# Altium schematic sheet TIDA-010954-Control.SchDoc
size 431 x 279 mm; Date: Not shown in title block; ApprovedBy: Not shown in title block; CheckedBy: Not shown in title block; Author: Not shown in title block; CompanyName: Not shown in title block; Engineer: Not shown in title block; Organization: Not shown in title block; Address1: Not shown in title block; Address2: Not shown in title block; Address3: Not shown in title block; Address4: Not shown in title block; DocumentNumber: 2; Revision: Use project parameter SCH_Rev; SheetNumber: 8; SheetTotal: 9; PageSetup: Record=PageOptions|CenterHorizontal=True|CenterVertical=True|PrintScale=1.00|XCorrection=1.00|YCorrection=1.00|PrintKind=0|BorderSize=5000000|LeftOffset=0|BottomOffset=0|Orientation=2|PaperLength=1000|PaperWidth=1000|Scale=100|PaperSource=15|PrintQuality=600|MediaType=1|DitherType=10|PaperKind=Letter|PrintScaleMode=1; CurrentTime: Not shown in title block; CurrentDate: Not shown in title block; Time: Not shown in title block; DocumentFullPathAndName: Not shown in title block; DocumentName: Not shown in title block; ModifiedDate: 1/25/2022; ImagePath: Not shown in title block
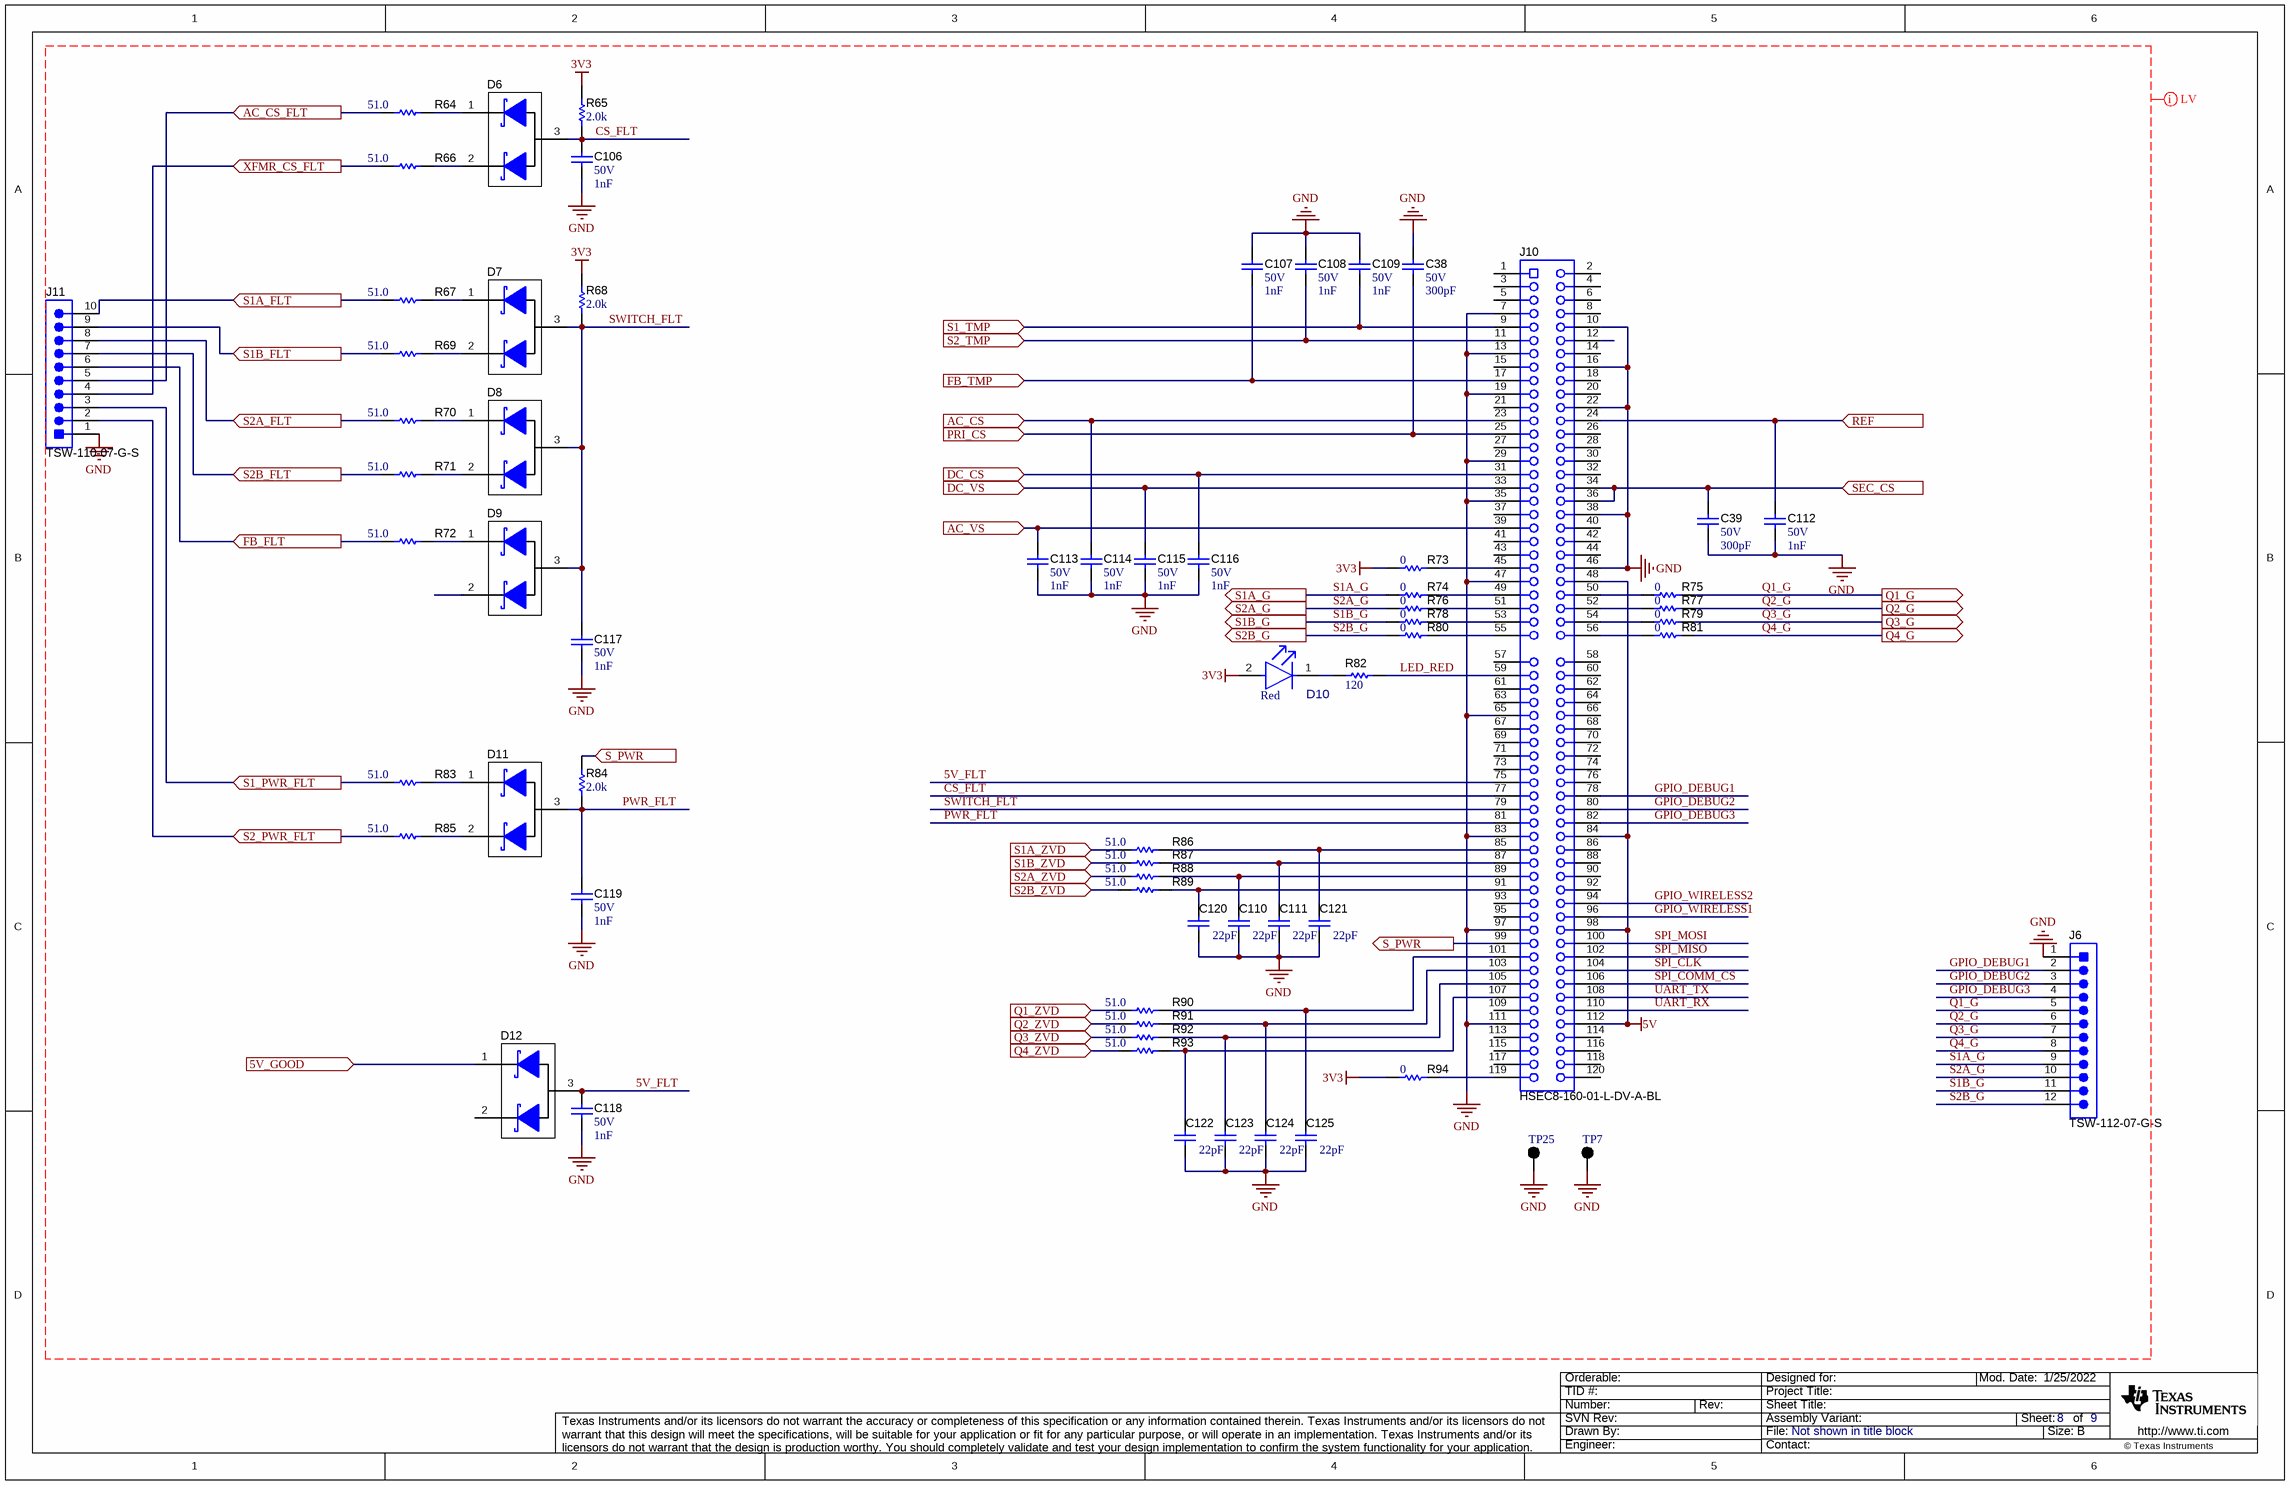
[diagram p0: TIDA-010954-Control.SchDoc]

## Parts
C38  VDC_V: 50V  ValueDisplayed: 300pF  [0603]  (hidden comment: GRM1885C1H301JA01D)
C39  VDC_V: 50V  ValueDisplayed: 300pF  [0603]  (hidden comment: GRM1885C1H301JA01D)
C106  VDC_V: 50V  ValueDisplayed: 1nF  [0603]  (hidden comment: GRM1885C1H102JA01D)
C107  VDC_V: 50V  ValueDisplayed: 1nF  [0603]  (hidden comment: GRM1885C1H102JA01D)
C108  VDC_V: 50V  ValueDisplayed: 1nF  [0603]  (hidden comment: GRM1885C1H102JA01D)
C109  VDC_V: 50V  ValueDisplayed: 1nF  [0603]  (hidden comment: GRM1885C1H102JA01D)
C110  ValueDisplayed: 22pF  [0603]  (hidden comment: GRM1885C1H220JA01D)
C111  ValueDisplayed: 22pF  [0603]  (hidden comment: GRM1885C1H220JA01D)
C112  VDC_V: 50V  ValueDisplayed: 1nF  [0603]  (hidden comment: GRM1885C1H102JA01D)
C113  VDC_V: 50V  ValueDisplayed: 1nF  [0603]  (hidden comment: GRM1885C1H102JA01D)
C114  VDC_V: 50V  ValueDisplayed: 1nF  [0603]  (hidden comment: GRM1885C1H102JA01D)
C115  VDC_V: 50V  ValueDisplayed: 1nF  [0603]  (hidden comment: GRM1885C1H102JA01D)
C116  VDC_V: 50V  ValueDisplayed: 1nF  [0603]  (hidden comment: GRM1885C1H102JA01D)
C117  VDC_V: 50V  ValueDisplayed: 1nF  [0603]  (hidden comment: GRM1885C1H102JA01D)
C118  VDC_V: 50V  ValueDisplayed: 1nF  [0603]  (hidden comment: GRM1885C1H102JA01D)
C119  VDC_V: 50V  ValueDisplayed: 1nF  [0603]  (hidden comment: GRM1885C1H102JA01D)
C120  ValueDisplayed: 22pF  [0603]  (hidden comment: GRM1885C1H220JA01D)
C121  ValueDisplayed: 22pF  [0603]  (hidden comment: GRM1885C1H220JA01D)
C122  ValueDisplayed: 22pF  [0603]  (hidden comment: GRM1885C1H220JA01D)
C123  ValueDisplayed: 22pF  [0603]  (hidden comment: GRM1885C1H220JA01D)
C124  ValueDisplayed: 22pF  [0603]  (hidden comment: GRM1885C1H220JA01D)
C125  ValueDisplayed: 22pF  [0603]  (hidden comment: GRM1885C1H220JA01D)
D6  BAT54AWT-TP  [SOT-323]  (value not drawn)
D7  BAT54AWT-TP  [SOT-323]  (value not drawn)
D8  BAT54AWT-TP  [SOT-323]  (value not drawn)
D9  BAT54AWT-TP  [SOT-323]  (value not drawn)
D10  Color: Red  [FP-APG1608SURKC_T_0603-MFG]  (hidden comment: APG1608SURKC/T)
D11  BAT54AWT-TP  [SOT-323]  (value not drawn)
D12  BAT54AWT-TP  [SOT-323]  (value not drawn)
J6  TSW-112-07-G-S  [TSW-112-07-G-S]
J10  HSEC8-160-01-L-DV-A-BL  [controlCARD-120HSEC]
J11  TSW-110-07-G-S  [TSW-110-07-G-S]
R64  ValueDisplayed: 51.0  [0603]  (hidden comment: RC0603FR-0751RL)
R65  ValueDisplayed: 2.0k  [0603]  (hidden comment: RC0603JR-072KL)
R66  ValueDisplayed: 51.0  [0603]  (hidden comment: RC0603FR-0751RL)
R67  ValueDisplayed: 51.0  [0603]  (hidden comment: RC0603FR-0751RL)
R68  ValueDisplayed: 2.0k  [0603]  (hidden comment: RC0603JR-072KL)
R69  ValueDisplayed: 51.0  [0603]  (hidden comment: RC0603FR-0751RL)
R70  ValueDisplayed: 51.0  [0603]  (hidden comment: RC0603FR-0751RL)
R71  ValueDisplayed: 51.0  [0603]  (hidden comment: RC0603FR-0751RL)
R72  ValueDisplayed: 51.0  [0603]  (hidden comment: RC0603FR-0751RL)
R73  ValueDisplayed: 0  [0603]  (hidden comment: RC0603JR-070RL)
R74  ValueDisplayed: 0  [0603]  (hidden comment: RC0603JR-070RL)
R75  ValueDisplayed: 0  [0603]  (hidden comment: RC0603JR-070RL)
R76  ValueDisplayed: 0  [0603]  (hidden comment: RC0603JR-070RL)
R77  ValueDisplayed: 0  [0603]  (hidden comment: RC0603JR-070RL)
R78  ValueDisplayed: 0  [0603]  (hidden comment: RC0603JR-070RL)
R79  ValueDisplayed: 0  [0603]  (hidden comment: RC0603JR-070RL)
R80  ValueDisplayed: 0  [0603]  (hidden comment: RC0603JR-070RL)
R81  ValueDisplayed: 0  [0603]  (hidden comment: RC0603JR-070RL)
R82  ValueDisplayed: 120  [0603]  (hidden comment: RC0603FR-07120RL)
R83  ValueDisplayed: 51.0  [0603]  (hidden comment: RC0603FR-0751RL)
R84  ValueDisplayed: 2.0k  [0603]  (hidden comment: RC0603JR-072KL)
R85  ValueDisplayed: 51.0  [0603]  (hidden comment: RC0603FR-0751RL)
R86  ValueDisplayed: 51.0  [0603]  (hidden comment: RC0603FR-0751RL)
R87  ValueDisplayed: 51.0  [0603]  (hidden comment: RC0603FR-0751RL)
R88  ValueDisplayed: 51.0  [0603]  (hidden comment: RC0603FR-0751RL)
R89  ValueDisplayed: 51.0  [0603]  (hidden comment: RC0603FR-0751RL)
R90  ValueDisplayed: 51.0  [0603]  (hidden comment: RC0603FR-0751RL)
R91  ValueDisplayed: 51.0  [0603]  (hidden comment: RC0603FR-0751RL)
R92  ValueDisplayed: 51.0  [0603]  (hidden comment: RC0603FR-0751RL)
R93  ValueDisplayed: 51.0  [0603]  (hidden comment: RC0603FR-0751RL)
R94  ValueDisplayed: 0  [0603]  (hidden comment: RC0603JR-070RL)
TP7  5011  [Keystone5011]  (value not drawn)
TP25  5011  [Keystone5011]  (value not drawn)

## Ports
5V_GOOD (in), AC_CS (in), AC_CS_FLT (in), AC_VS (in), DC_CS (in), DC_VS (in), FB_FLT (in), FB_TMP (in), PRI_CS (in), Q1_G (out), Q1_ZVD (in), Q2_G (out), Q2_ZVD (in), Q3_G (out), Q3_ZVD (in), Q4_G (out), Q4_ZVD (in), REF (in), S1_PWR_FLT (in), S1_TMP (in), S1A_FLT (in), S1A_G (out), S1A_ZVD (in), S1B_FLT (in), S1B_G (out), S1B_ZVD (in), S2_PWR_FLT (in), S2_TMP (in), S2A_FLT (in), S2A_G (out), S2A_ZVD (in), S2B_FLT (in), S2B_G (out), S2B_ZVD (in), S_PWR (in), S_PWR (out), SEC_CS (in), XFMR_CS_FLT (in)

## Nets
3V3: D10.2(ANODE) R65.2 R68.2 R73.1 R94.1
5V: J10.48 J10.84 J10.98 J10.112
GND: C38.2 C39.2 C106.2 C107.1 C108.1 C109.1 C110.2 C111.2 C112.2 C113.2 C114.2 C115.2 C116.2 C117.2 C118.2 C119.2 C120.2 C121.2 C122.2 C123.2 C124.2 C125.2 J6.1 J10.7 J10.10 J10.13 J10.16 J10.19 J10.22 J10.29 J10.35 J10.38 J10.46 J10.47 J10.65 J10.83 J10.97 J10.111 J11.1 TP7.1 TP25.1
5V_FLT: C118.1 D12.3(A) J10.75
5V_GOOD: D12.1(A) ; port 5V_GOOD
AC_CS: C114.1 J10.23 ; port AC_CS
AC_CS_FLT: J11.5 R64.1 ; port AC_CS_FLT
AC_VS: C113.1 J10.39 ; port AC_VS
CS_FLT: C106.1 D6.3(A) J10.77 R65.1
DC_CS: C116.1 J10.31 ; port DC_CS
DC_VS: C115.1 J10.33 ; port DC_VS
FB_FLT: J11.6 R72.1 ; port FB_FLT
FB_TMP: C107.2 J10.17 ; port FB_TMP
GPIO_DEBUG1: J6.2 J10.78
GPIO_DEBUG2: J6.3 J10.80
GPIO_DEBUG3: J6.4 J10.82
GPIO_WIRELESS1: J10.96
GPIO_WIRELESS2: J10.94
LED_RED: J10.59 R82.2
PRI_CS: C38.1 J10.25 ; port PRI_CS
PWR_FLT: C119.1 D11.3(A) J10.81 R84.1
Q1_G: J6.5 R75.2 ; port Q1_G
Q1_ZVD: R90.1 ; port Q1_ZVD
Q2_G: J6.6 R77.2 ; port Q2_G
Q2_ZVD: R91.1 ; port Q2_ZVD
Q3_G: J6.7 R79.2 ; port Q3_G
Q3_ZVD: R92.1 ; port Q3_ZVD
Q4_G: J6.8 R81.2 ; port Q4_G
Q4_ZVD: R93.1 ; port Q4_ZVD
REF: C112.1 J10.24 ; port REF
S1_PWR_FLT: J11.3 R83.1 ; port S1_PWR_FLT
S1_TMP: C109.2 J10.9 ; port S1_TMP
S1A_FLT: J11.10 R67.1 ; port S1A_FLT
S1A_G: J6.9 R74.1 ; port S1A_G
S1A_ZVD: R86.1 ; port S1A_ZVD
S1B_FLT: J11.9 R69.1 ; port S1B_FLT
S1B_G: J6.11 R78.1 ; port S1B_G
S1B_ZVD: R87.1 ; port S1B_ZVD
S2_PWR_FLT: J11.2 R85.1 ; port S2_PWR_FLT
S2_TMP: C108.2 J10.11 ; port S2_TMP
S2A_FLT: J11.8 R70.1 ; port S2A_FLT
S2A_G: J6.10 R76.1 ; port S2A_G
S2A_ZVD: R88.1 ; port S2A_ZVD
S2B_FLT: J11.7 R71.1 ; port S2B_FLT
S2B_G: J6.12 R80.1 ; port S2B_G
S2B_ZVD: R89.1 ; port S2B_ZVD
S_PWR: J10.99 R84.2 ; port S_PWR
SEC_CS: C39.1 J10.34 J10.36 ; port SEC_CS
SPI_CLK: J10.104
SPI_COMM_CS: J10.106
SPI_MISO: J10.102
SPI_MOSI: J10.100
SWITCH_FLT: C117.1 D7.3(A) D8.3(A) D9.3(A) J10.79 R68.1
UART_RX: J10.110
UART_TX: J10.108
XFMR_CS_FLT: J11.4 R66.1 ; port XFMR_CS_FLT
NetC110_1: C110.1 J10.89 R88.2
NetC111_1: C111.1 J10.87 R87.2
NetC120_1: C120.1 J10.91 R89.2
NetC121_1: C121.1 J10.85 R86.2
NetC122_1: C122.1 J10.107 R93.2
NetC123_1: C123.1 J10.105 R92.2
NetC124_1: C124.1 J10.103 R91.2
NetC125_1: C125.1 J10.101 R90.2
NetD6_1: D6.1(A) R64.2
NetD6_2: D6.2(K) R66.2
NetD7_1: D7.1(A) R67.2
NetD7_2: D7.2(K) R69.2
NetD8_1: D8.1(A) R70.2
NetD8_2: D8.2(K) R71.2
NetD9_1: D9.1(A) R72.2
NetD10_1: D10.1(CATHODE) R82.1
NetD11_1: D11.1(A) R83.2
NetD11_2: D11.2(K) R85.2
NetJ10_45: J10.45 R73.2
NetJ10_49: J10.49 R74.2
NetJ10_50: J10.50 R75.1
NetJ10_51: J10.51 R76.2
NetJ10_52: J10.52 R77.1
NetJ10_53: J10.53 R78.2
NetJ10_54: J10.54 R79.1
NetJ10_55: J10.55 R80.2
NetJ10_56: J10.56 R81.1
NetJ10_119: J10.119 R94.2

Not connected (* = marked no-connect by the designer): D9 2(K); D12 2(K); J10 1 2 3 4 5 6 8 12 14 15 18 20 21 26 27 28 30 32 37 40 41 42 43 44 57 58 60 61 62 63 64 66 67 68 69 70 71 72 73 74 76 86 88 90 92 93 95 109 113 114 115 116 117 118 120

## Layout directives
net class LV: 3V3, 5V, 5V_FLT, CS_FLT, GND, GPIO_DEBUG1, GPIO_DEBUG2, GPIO_DEBUG3, GPIO_WIRELESS1, GPIO_WIRELESS2, LED_RED, PWR_FLT, Q1_G, Q2_G, Q3_G, Q4_G, S1A_G, S1B_G, S2A_G, S2B_G, SPI_CLK, SPI_COMM_CS, SPI_MISO, SPI_MOSI, SWITCH_FLT, UART_RX, UART_TX

## Notes on the sheet
- Drawn By:
- SVN Rev:
- Number:
- TID #:
- Orderable:
- Rev:
- Sheet Title:
- File:
- Project Title:
- Designed for:
- Assembly Variant:
- Mod. Date:
- Sheet:
- Size:
- of
- B
- http://www.ti.com
- Texas Instruments and/or its licensors do not warrant the accuracy or completeness of this specification or any information contained therein. Texas Instruments and/or its licensors do not warrant that this design will meet the specifications, will be suitable for your application or fit for any particular purpose, or will operate in an implementation. Texas Instruments and/or its licensors do not warrant that the design is production worthy. You should completely validate and test your design implementation to confirm the system functionality for your application.
- Engineer:
- Contact:
- © Texas Instruments

## Library data of the parts
C38 C39 = CMP-0007206-4: CAP, CERM, 300 pF, 50 V, +/- 5%, C0G/NP0, 0603; Manufacturer: MuRata; TaMin_C: -55°C; Polarized: N; SizeAreaWB_mm2: 4.68; Value1: Unknown; U/M: EA; Value: 300pF; TaMax_C: 125°C; SizeZ_mm: 1; SizeX_mm: 1.6; SizeY_mm: 0.8; SizeArea_mm2: 1.28; AEC Category: Q200; Supplier Part Number 2: 81-GRM185C1H301JA01D; Publisher: Texas Instruments; Supplier 2: Mouser; TempCo: C0G/NP0; Published: 2008-06-19; RoHS: Y; MountType: SMT; Supplier 1: Digi-Key; PackageReference: 0603; Tolerance_%: 5%; Cap_Case: 0603; Value2: 50V; CompType: Capacitor; LatestRevisionDate: 2017-03-09; PartNumber: GRM1885C1H301JA01D; AEC Qualified: ?; Cap_F: 300pF; ComponentLink1Description: Datasheet link; Supplier Part Number 1: 490-1438-1-ND; Technology: Ceramic; ComponentLink1URL: http://search.murata.co.jp/Ceramy/PnsearchViewAction.do?HnOFG=ON&HnNFG=ON&SEL_CNT=50&sLang=en&sKey=GRM1885C1H301JA01D&x=9&y=9&search=startwith
C106-C109 C112-C119 = CMP-0007173-4: CAP, CERM, 1000 pF, 50 V, +/- 5%, C0G/NP0, 0603; Manufacturer: MuRata; TaMin_C: -55°C; Polarized: N; SizeAreaWB_mm2: 4.68; Value1: Unknown; U/M: EA; Value: 1000pF; TaMax_C: 125°C; SizeZ_mm: 1; SizeX_mm: 1.6; SizeY_mm: 0.8; SizeArea_mm2: 1.28; AEC Category: Q200; Supplier Part Number 2: 81-GRM39C102J50; Publisher: Texas Instruments; Supplier 2: Mouser; Supplier Part Number 3: 8819920; TempCo: C0G/NP0; Supplier 3: Farnell; Published: 2008-06-19; RoHS: Y; MountType: SMT; Supplier 1: Digi-Key; PackageReference: 0603; Tolerance_%: 5%; Cap_Case: 0603; Value2: 50V; CompType: Capacitor; LatestRevisionDate: 2017-03-09; PartNumber: GRM1885C1H102JA01D; AEC Qualified: ?; Cap_F: 1nF; ComponentLink1Description: Datasheet link; Supplier Part Number 1: 490-1451-1-ND; Technology: Ceramic; ComponentLink1URL: http://search.murata.co.jp/Ceramy/PnsearchViewAction.do?HnOFG=ON&HnNFG=ON&SEL_CNT=50&sLang=en&sKey=GRM1885C1H102JA01D&x=9&y=9&search=startwith
C110 C111 C120-C125 = CMP-0007196-4: CAP, CERM, 22 pF, 50 V, +/- 5%, C0G/NP0, 0603; Manufacturer: MuRata; TaMin_C: -55°C; Polarized: N; SizeAreaWB_mm2: 4.68; Value1: Unknown; U/M: EA; Value: 22pF; TaMax_C: 125°C; SizeZ_mm: 1; SizeX_mm: 1.6; SizeY_mm: 0.8; Value2: 50V; SizeArea_mm2: 1.28; AEC Category: Q200; Supplier Part Number 2: 81-GRM39C220J50; Publisher: Texas Instruments; Supplier 2: Mouser; Supplier Part Number 3: 8819831; TempCo: C0G/NP0; Supplier 3: Farnell; Published: 2008-06-19; RoHS: Y; MountType: SMT; Supplier 1: Digi-Key; PackageReference: 0603; Tolerance_%: 5%; Cap_Case: 0603; CompType: Capacitor; LatestRevisionDate: 2017-03-09; PartNumber: GRM1885C1H220JA01D; AEC Qualified: ?; Cap_F: 22pF; VDC_V: 50V; ComponentLink1Description: Datasheet link; Supplier Part Number 1: 490-1411-1-ND; Technology: Ceramic; ComponentLink1URL: http://search.murata.co.jp/Ceramy/PnsearchViewAction.do?HnOFG=ON&HnNFG=ON&SEL_CNT=50&sLang=en&sKey=GRM1885C1H220JA01D&x=9&y=9&search=startwith
D6-D9 D11 D12 = CMP-0028627-2: Diode, Schottky, 30 V, 0.2 A, SOT-323; Manufacturer: Micro Commercial Components; SizeArea_mm2: 4.84; Io_A: 200mA; Value2: 1V; Value1: 0.2A; TJmax_C: 125°C; SizeY_mm: 2.2; AEC Category: Q101; SizeZ_mm: 1.1; Green_REACh: Incomplete; Value: 30V; Green_Lifecycle: Not Set; SizeAreaWB_mm2: 10.24; Green_EU RoHS: Incomplete; MountType: SMT; RoHS: Y; CompType: Diode; AEC Qualified: ?; Vf_V: 1V; PackageReference: SOT-323; ComponentLink1URL: http://www.mccsemi.com/up_pdf/BAT54WT~BAT54SWT(SOT-323).pdf; SizeX_mm: 2.2; PartNumber: BAT54AWT-TP; ComponentLink1Description: Datasheet link; Vr_V: 30V; Type: Schottky; Green_EU RoHS-2: Incomplete
D10 = CMP-0091305-2: Red 630nm LED Indication - Discrete 2V 0603 (1608 Metric); Manufacturer: Kingbright; AEC Qualified: No; Import Ts: 1521847491; Forward Current: 20mA; Vr_V: 5V; Ciiva Ids: 1546259; Luminous Intensity: 110mcd; Power_TotalModule: 75mW; Tjmax_C: 115°C; Led Orientation: Top View; SizeZ_mm: 0.28mm; LambdaP: 645nm; Angle: 120°; ComponentLink1Description: Datasheet; PackageReference: 0603; Release Date: 1390185805; Mouser Part Number: 604-APG1608SURKC/T; PartNumber: APG1608SURKC/T; Digikey Part Number: 754-1359-1-ND; Mouser Description: APG1608SURKC/T Red LED, 630 nm 1608 (0603) Clear, Rectangle Lens SMD package; RoHS: TRUE; LambdaD: 630nm; Lead Free: Yes; Vf_V: 2V; Part Number: APG1608SURKC/T; ComponentLink1URL: https://www.kingbrightusa.com/images/catalog/SPEC/APG1608SURKC-T.pdf; helpURL: https://upverter.com/upn/revision/2eb98c3e10735b4d/; datasheet: https://www.kingbrightusa.com/images/catalog/SPEC/APG1608SURKC-T.pdf; Digikey Description: LED RED CLEAR CHIP SMD; Operating Temperature Range: -40°C to +85°C; Datasheet Path: datasheets/Diode-APG1608SURKC_T.pdf; Vault Guid: 951D1CBD-CFDD-403F-A235-A7AC0CBD640F
J6 = CMP-0075424-1: Header, 100mil, 12x1, Gold, TH; Manufacturer: Samtec; Pitch_mm: 2.54; Cert_VDE: N; Gender: Male; Cert_CSA: Y; Current_A: 6.3A; Voltage_V: 550V; CT: False; Row_Count: 1; CNHeader: True; ComponentLink1Description: Datasheet URL; RoHS: Y; Supplier 1: Digi-Key; Cert_UL: Y; Orientation: Vertical; PackageReference: 12x1 Header; Color: Black; PartNumber: TSW-112-07-G-S; PinCount: 12; Publisher: Texas Instruments; ContactFinish: Gold; Cert_CULUS: N; Shrouded: N; ClassName: Header; ComponentLink1URL: http://samtec.com/ftppub/pdf/TSW_TH.PDF; LatestRevisionDate: 2017-07-12; CompType: Header; MountType: TH; Supplier Part Number 1: SAM1029-12-ND
J10 = CMP-0003814-2: C2000 controlCARD-120HSEC connector, SMT; Manufacturer: Samtec; Note: The pin numbering does not match Samtec datasheet; ComponentLink1URL: http://www.samtec.com/ftppub/pdf/hsec8_dv.pdf; CompType: Connector; PackageReference: C2000 pin numbering; RoHS: Y; MountType: SMT; PartNumber: HSEC8-160-01-L-DV-A-BL; ComponentLink1Description: Datasheet Link
J11 = CMP-0075422-1: Header, 100mil, 10x1, Gold, TH; Manufacturer: Samtec; Pitch_mm: 2.54; Cert_VDE: N; Gender: Male; Cert_CSA: Y; Voltage_V: 550V; Green_REACh: Passed; Current_A: 6.3A; CT: False; Green_Lifecycle: Active; Row_Count: 1; CNHeader: True; ComponentLink1Description: Datasheet URL; RoHS: Y; Supplier 1: Digi-Key; Cert_UL: Y; Orientation: Vertical; Green_EU RoHS: Passed; PackageReference: 10x1 Header; Color: Black; PartNumber: TSW-110-07-G-S; PinCount: 10; Publisher: Texas Instruments; ContactFinish: Gold; Cert_CULUS: N; Shrouded: N; ClassName: Header; ComponentLink1URL: http://samtec.com/ftppub/pdf/TSW_TH.PDF; LatestRevisionDate: 2017-07-12; CompType: Header; MountType: TH; Supplier Part Number 1: SAM1029-10-ND; Green_EU RoHS-2: Passed
R64 R66 R67 R69-R72 R83 R85-R93 = CMP-0023169-5: RES, 51.0, 1%, 0.1 W, 0603; Manufacturer: Yageo; Power_W: 100mW; TempCo: 100 ppm/C; Value_Code: 51R0; Value: 51.0; Res_ohm: 51; SizeX_mm: 1.6; SizeY_mm: 0.8; SizeZ_mm: 1; Value2: 0.1W; SizeArea_mm2: 1.28; AEC Qualified: N; VDC_V: 75V; AEC Category: Q200; SizeAreaWB_mm2: 4.68; Supplier Part Number 2: 603-RC0603FR-0751RL; Supplier 2: Mouser; Supplier Part Number 3: 1799350; Supplier 3: Farnell; RoHS: Y; Value1: 1%; Supplier 1: Digi-Key; PackageReference: 0603; Tolerance_%: 1%; CompType: Resistor; PartNumber: RC0603FR-0751RL; ComponentLink1Description: Datasheet link; Supplier Part Number 1: 311-51.0HRCT-ND; Technology: Thick Film; MountType: SMT; ComponentLink1URL: http://www.yageo.com/pdf/Pu-RC0603_51_PbFree_L_2.pdf; AEC Grade: N/A
R65 R68 R84 = CMP-0025909-5: RES, 2.0 k, 5%, 0.1 W, 0603; Manufacturer: Yageo; Power_W: 100mW; TempCo: 100 ppm/C; Value_Code: 2k00; Value: 2.0k; EIA_Code: E24; Res_ohm: 2k; SizeX_mm: 1.6; SizeY_mm: 0.8; SizeZ_mm: 1; Value2: 0.1W; SizeArea_mm2: 1.28; AEC Qualified: N; VDC_V: 75V; AEC Category: Q200; SizeAreaWB_mm2: 4.68; Supplier Part Number 2: 603-RC0603JR-072KL; Supplier 2: Mouser; Supplier Part Number 3: 1799398; Supplier 3: Farnell; RoHS: Y; Value1: 5%; MountType: SMT; Supplier 1: Digi-Key; PackageReference: 0603; Tolerance_%: 5%; CompType: Resistor; PartNumber: RC0603JR-072KL; ComponentLink1Description: Datasheet link; Supplier Part Number 1: 311-2.0KGRCT-ND; Technology: Thick Film; ComponentLink1URL: http://www.yageo.com/pdf/Pu-RC0603_51_PbFree_L_2.pdf; AEC Grade: N/A
R73-R81 R94 = CMP-0025885-5: RES, 0, 5%, 0.1 W, 0603; Manufacturer: Yageo; Power_W: 100mW; TempCo: 200 ppm/C; Value_Code: 0000; Value: 0; EIA_Code: E24; SizeX_mm: 1.6; SizeZ_mm: 1; Value2: 0.1W; SizeArea_mm2: 1.28; AEC Qualified: N; VDC_V: 75V; AEC Category: Q200; SizeY_mm: 0.8; SizeAreaWB_mm2: 4.68; Supplier Part Number 2: 603-RC0603JR-070RL; Supplier 2: Mouser; Supplier Part Number 3: 9233130; Supplier 3: Farnell; RoHS: Y; Value1: 5%; MountType: SMT; Supplier 1: Digi-Key; PackageReference: 0603; Tolerance_%: 5%; Res_ohm: 0; CompType: Resistor; PartNumber: RC0603JR-070RL; ComponentLink1Description: Datasheet link; Supplier Part Number 1: 311-0.0GRCT-ND; Technology: Thick Film; ComponentLink1URL: http://www.yageo.com/pdf/Pu-RC0603_51_PbFree_L_2.pdf; AEC Grade: N/A
R82 = CMP-0022769-5: RES, 120, 1%, 0.1 W, 0603; Manufacturer: Yageo; Power_W: 100mW; TempCo: 100 ppm/C; Value_Code: 120R; Value: 120; SizeX_mm: 1.6; SizeY_mm: 0.8; SizeZ_mm: 1; Value2: 0.1W; SizeArea_mm2: 1.28; AEC Qualified: N; VDC_V: 75V; AEC Category: Q200; SizeAreaWB_mm2: 4.68; Supplier Part Number 2: 603-RC0603FR-07120RL; Supplier 2: Mouser; Supplier Part Number 3: 9238379; Supplier 3: Farnell; RoHS: Y; Value1: 1%; MountType: SMT; Supplier 1: Digi-Key; PackageReference: 0603; Tolerance_%: 1%; Res_ohm: 120; CompType: Resistor; PartNumber: RC0603FR-07120RL; ComponentLink1Description: Datasheet link; Supplier Part Number 1: 311-120HRCT-ND; Technology: Thick Film; ComponentLink1URL: http://www.yageo.com/pdf/Pu-RC0603_51_PbFree_L_2.pdf; AEC Grade: N/A
TP7 TP25 = CMP-0055148-2: Test Point, Multipurpose, Black, TH; Manufacturer: Keystone Electronics; CNHeader: FALSE; ContactFinish: Silver; Green_REACh: Passed; Green_Lifecycle: Active; CT: TRUE; ComponentLink1Description: Datasheet URL; Supplier 1: Digi-Key; MountType: TH; Supplier 2: Mouser; LatestRevisionDate: 26/05/2017; Publisher: Texas Instruments; PartNumber: 5011; Color: Black; ComponentLink1URL: http://www.keyelco.com/userAssets/file/M60-2p60.pdf; Green_EU RoHS-2: Incomplete; Supplier Part Number 1: 36-5011-ND; Supplier Part Number 2: 534-5011; Green_EU RoHS: Passed; RoHS: Y; PackageReference: Black Multipurpose Testpoint; CompType: Test Point